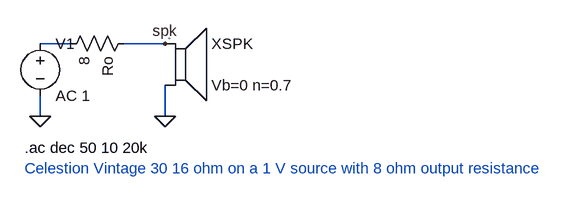
[diagram p0: schematic demo_speaker.asc]
demo_speaker.asc, the LTspice schematic file:
Version 4
SHEET 1 700 320
WIRE 64 96 112 96
WIRE 192 96 256 96
WIRE 64 176 64 208
WIRE 256 160 256 208
FLAG 64 208 0
FLAG 256 208 0
FLAG 256 96 spk
SYMBOL voltage 64 80 R0
SYMATTR InstName V1
SYMATTR Value AC 1
SYMBOL res 208 80 R90
SYMATTR InstName Ro
SYMATTR Value 8
SYMBOL SPK_V30_16 256 64 R0
SYMATTR InstName XSPK
SYMATTR Value Vb=0 n=0.7
TEXT 40 256 Left 2 !.ac dec 50 10 20k
TEXT 40 288 Left 2 ;Celestion Vintage 30 16 ohm on a 1 V source with 8 ohm output resistance

The netlist it stands for:
* demo_speaker.asc
V1 N001 0 AC 1
Ro spk N001 8
XXSPK spk 0 SPK_V30_16 Vb=0 n=0.7  ; pins P N
.ac dec 50 10 20k
* Celestion Vintage 30 16 ohm on a 1 V source with 8 ohm output resistance
.lib speaker.sub
.backanno
.end